# Altium project Gimbal 2020.PrjPcb
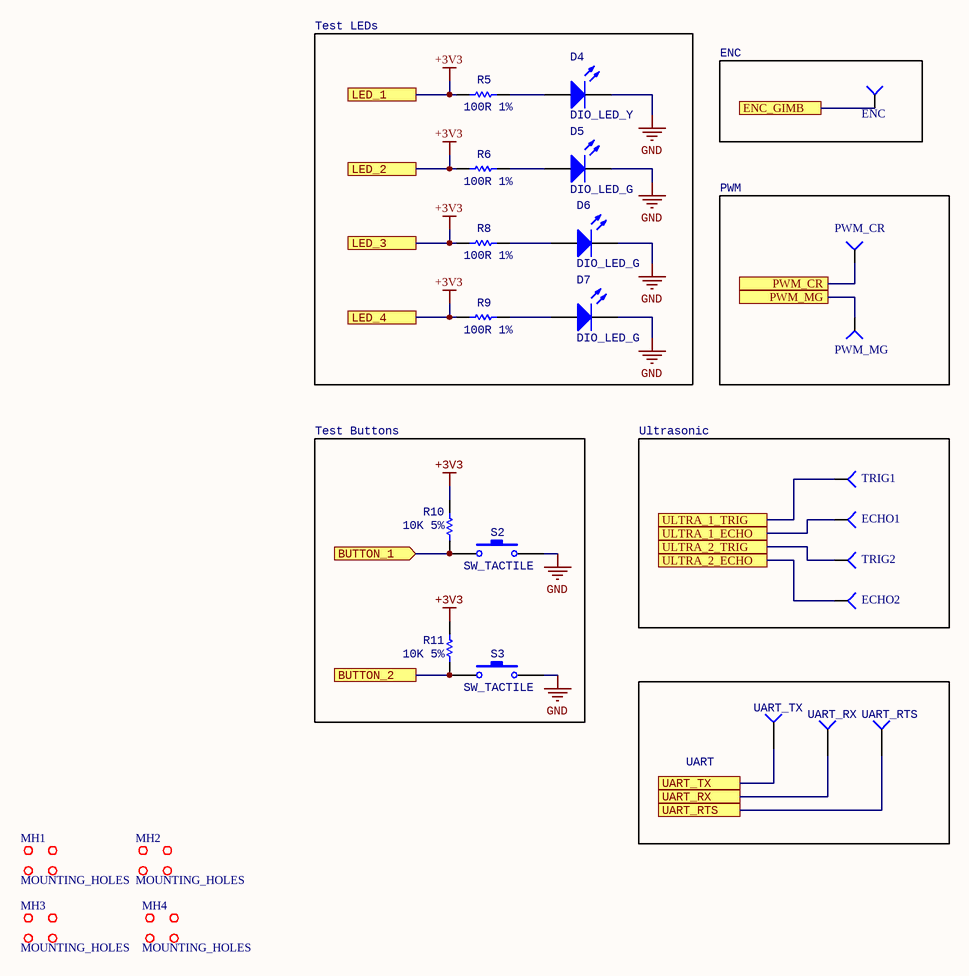
[diagram p0: Support.SchDoc]
5 sheets, 79 parts. Net scope: flat (ports and power ports of the same name join across sheets).
Sheets:
  Support.SchDoc
  Connectors.SchDoc
  POWER.SchDoc
  can.SchDoc
  MCU.SchDoc

## Sheet Support.SchDoc: Gimbal Support Schematic
size Letter; DrawnBy: Aidan Gratton; Organization: UW Robotics; Address1: 200 University Avenue; Address2: Waterloo; Address3: Ontario; Address4: Canada N2L 3G6; SheetNumber: 4; SheetTotal: 5

### Parts
D4  DIO_LED_Y  [LED_0805_LINE]
D5  DIO_LED_G  [LED_0805_LINE]
D6  DIO_LED_G  [LED_0805_LINE]
D7  DIO_LED_G  [LED_0805_LINE]
MH1  MOUNTING_HOLES  [MOUNTING_HOLE]
MH2  MOUNTING_HOLES  [MOUNTING_HOLE]
MH3  MOUNTING_HOLES  [MOUNTING_HOLE]
MH4  MOUNTING_HOLES  [MOUNTING_HOLE]
R5  value 100R 1%  [RESC0603(1608)_N]  (hidden comment: RES_100R_0603)
R6  value 100R 1%  [RESC0603(1608)_N]  (hidden comment: RES_100R_0603)
R8  value 100R 1%  [RESC0603(1608)_N]  (hidden comment: RES_100R_0603)
R9  value 100R 1%  [RESC0603(1608)_N]  (hidden comment: RES_100R_0603)
R10  value 10K 5%  [RESC0603(1608)_N]  (hidden comment: RES_10K_0603)
R11  value 10K 5%  [RESC0603(1608)_N]  (hidden comment: RES_10K_0603)
S2  SW_TACTILE  [B3U-1100P]
S3  SW_TACTILE  [B3U-1100P]
TP8  TRIG1  [TESTPOINT]
TP9  PWM_CR  [TESTPOINT]
TP10  ENC  [TESTPOINT]
TP11  ECHO1  [TESTPOINT]
TP12  TRIG2  [TESTPOINT]
TP13  ECHO2  [TESTPOINT]
TP14  PWM_MG  [TESTPOINT]
UART_RTS  TESTPOINT  (value not drawn)
UART_RX  TESTPOINT  (value not drawn)
UART_TX  TESTPOINT  (value not drawn)

### Blocks framed on the sheet
Test LEDs: D4-D7 R5 R6 R8 R9
ENC: TP10
PWM: TP9 TP14
Test Buttons: R10 R11 S2 S3
Ultrasonic: TP8 TP11-TP13
UART: UART_RTS UART_RX UART_TX

### Ports
BUTTON_1 (in), BUTTON_2, ENC_GIMB, LED_1, LED_2, LED_3, LED_4, PWM_CR, PWM_MG, UART_RTS, UART_RX, UART_TX, ULTRA_1_ECHO, ULTRA_1_TRIG, ULTRA_2_ECHO, ULTRA_2_TRIG

### Nets
+3V3: R5.1 R6.1 R8.1 R9.1 R10.1 R11.2 ; port LED_1, port LED_2, port LED_3, port LED_4
GND: D4.2(K) D5.2(K) D6.2(K) D7.2(K) S2.2 S3.2
NetD4_1: D4.1(A) R5.2
NetD5_1: D5.1(A) R6.2
NetD6_1: D6.1(A) R8.2
NetD7_1: D7.1(A) R9.2
NetDEBUG_2: UART_TX.1(=value) ; port UART_TX
NetDEBUG_3: UART_RX.1(=value) ; port UART_RX
NetDEBUG_4: UART_RTS.1(=value) ; port UART_RTS
NetENC1_2: TP10.1(=value) ; port ENC_GIMB
NetR10_2: R10.2 S2.1 ; port BUTTON_1
NetR11_1: R11.1 S3.1 ; port BUTTON_2
NetSTM1_35: TP9.1(=value) ; port PWM_CR
NetSTM1_36: TP14.1(=value) ; port PWM_MG
NetSTM1_58: TP8.1(=value) ; port ULTRA_1_TRIG
NetSTM1_59: TP11.1(=value) ; port ULTRA_1_ECHO
NetSTM1_61: TP12.1(=value) ; port ULTRA_2_TRIG
NetSTM1_62: TP13.1(=value) ; port ULTRA_2_ECHO

### Notes on the sheet
- Title
- Size:
- Date:
- Letter
- Drawn By:
- Sheet
- of
- File:

### Library data of the parts
D4 = DIO_LED_Y: LED YELLOW DIFFUSED 0805 SMD; Manufacturer: OSRAM; MPN: LY R976-PS-36; Forward Voltage Drop: 2.2V; Package: 0805 (2012 Metric); Digikey Part Number: 475-2560-1-ND
D5-D7 = DIO_LED_G: LED GREEN DIFFUSED 0805 SMD; Manufacturer: OSRAM; MPN: LG R971-KN-1; Forward Voltage Drop: 2.2V; Package: 0805 (2012 Metric); Digikey Part Number: 475-1410-1-ND
MH1-MH4 = MOUNTING_HOLES: 6cm x 6cm
R5 R6 R8 R9 = RES_100R_0603: RES SMD 100 OHM 1% 1/10W 0603; Manufacturer: Yageo; MPN: RC0603FR-07100RL; Package: 0603 (1608 Metric); Dimensions: 0.063" L x 0.031" W (1.60mm x 0.80mm); Tolerance: 1%; Digikey Part Number: 311-100HRCT-ND
R10 R11 = RES_10K_0603: RES SMD 10K OHM 5% 1/10W 0603; Manufacturer: Yageo; MPN: RC0603JR-0710KL; Package: 0603 (1608 Metric); Dimensions: 0.063" L x 0.031" W (1.60mm x 0.80mm); Tolerance: 5%; Digikey Part Number: 311-10KGRCT-ND
S2 S3 = SW_TACTILE: Tactile Switch (Grey); Manufacturer: Omron Electronics Inc-EMC Div; Digikey Part Number: SW1021TR-ND; MPN: B3U-1100P
TP8-TP14 = TESTPOINT_SMD: Part Number (MPN): *

## Sheet Connectors.SchDoc: Gimbal Connecters Schematic
size Letter; DrawnBy: Jing Hao Yao & Aidan Gratton; Organization: UW Robotics; Address1: 200 University Avenue; Address2: Waterloo; Address3: Ontario; Address4: Canada N2L 3G6; SheetNumber: 5; SheetTotal: 5
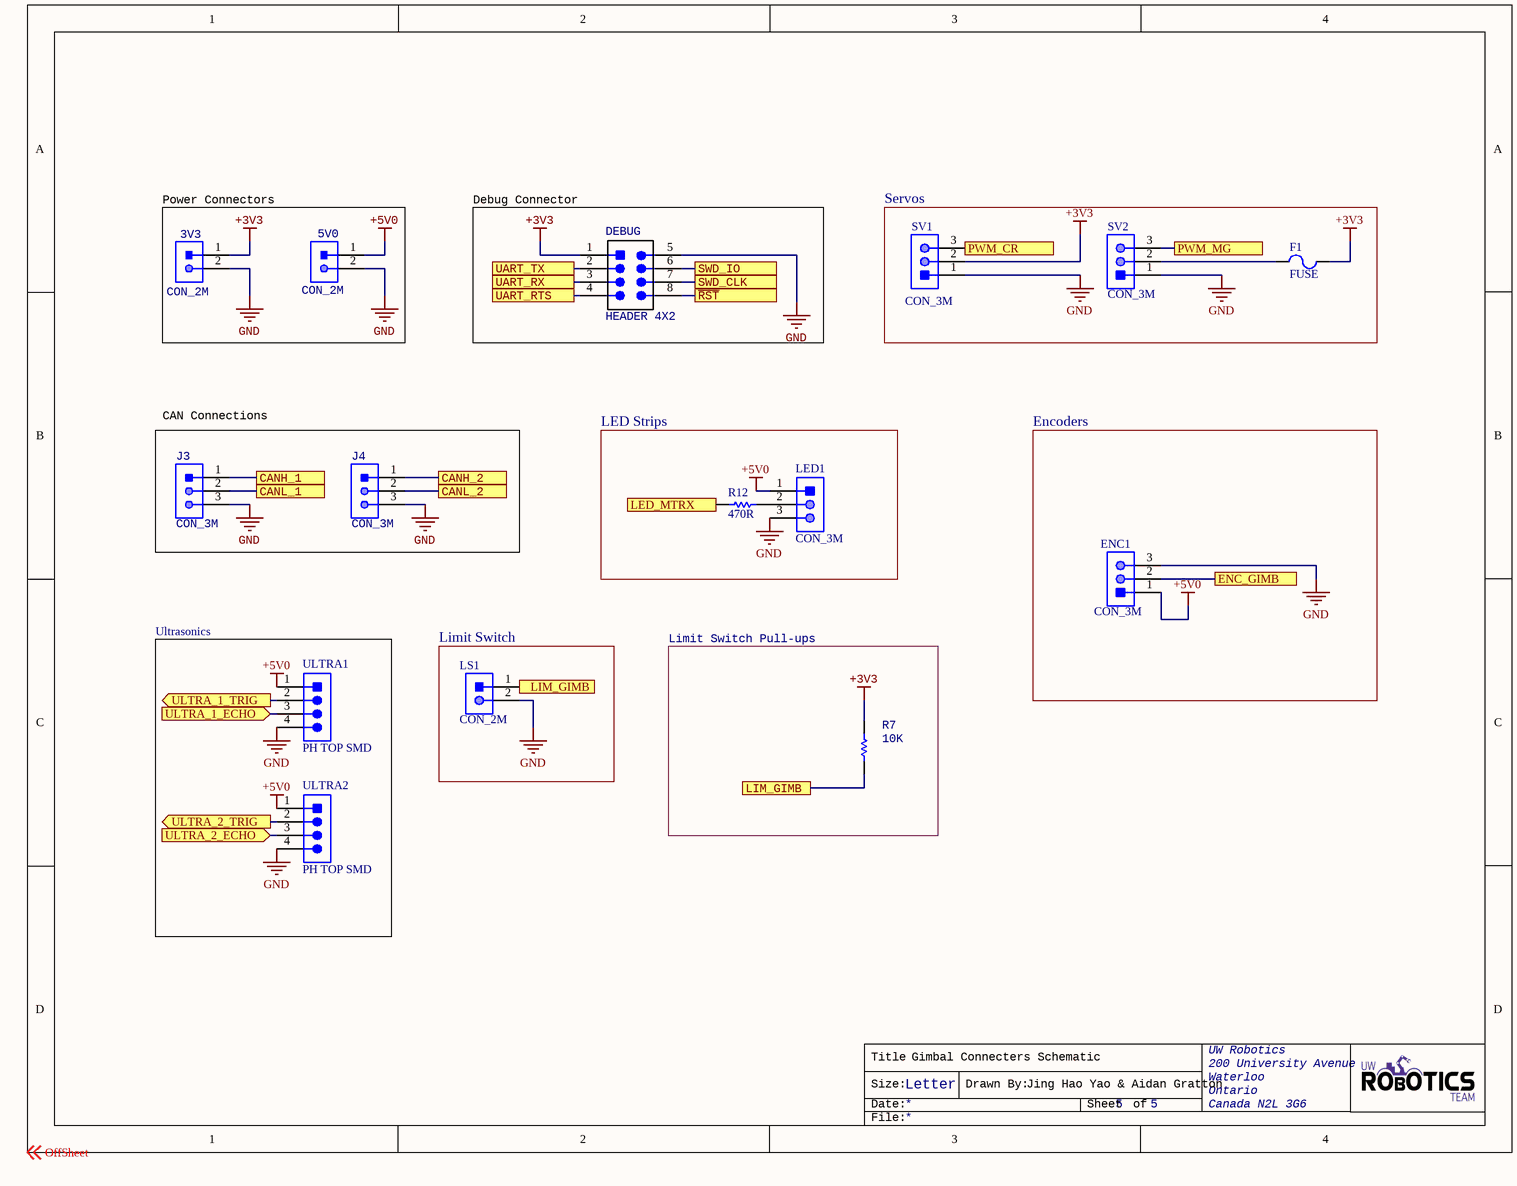
[diagram p1: Connectors.SchDoc]

### Parts
3V3  CON_2M  [JST-B2B-PHSK]
5V0  CON_2M  [JST-B2B-PHSK]
DEBUG  HEADER 4X2  [HEADER_2X4]
ENC1  CON_3M  [JST-B3B-SM4-TB]
F1  FUSE  [FUSE]
J3  CON_3M  [JST-B3B-SM4-TB]
J4  CON_3M  [JST-B3B-SM4-TB]
LED1  CON_3M  [JST-B3B-SM4-TB]
LS1  CON_2M  [JST-B2B-SM4-TB]
R7  value 10K  [RESC0603(1608)_N]  (hidden comment: RES_10K_0603)
R12  value 470R  [RESC0603(1608)_N]  (hidden comment: 470R 1%)
SV1  CON_3M  [JST-B3B-SM4-TB]
SV2  CON_3M  [JST B03B-PASK]
ULTRA1  PH TOP SMD  [JST-B4B-SM4-TB]
ULTRA2  PH TOP SMD  [JST-B4B-SM4-TB]

### Blocks framed on the sheet
Power Connectors: 3V3 5V0
Debug Connector: DEBUG
Servos: F1 SV1 SV2
CAN Connections: J3 J4
LED Strips: LED1 R12
Encoders: ENC1
Ultrasonics: ULTRA1 ULTRA2
Limit Switch: LS1
Limit Switch Pull-ups: R7

### Ports
CANH_1, CANH_2, CANL_1, CANL_2, ENC_GIMB, LED_MTRX, LIM_GIMB, PWM_CR, PWM_MG, SWD_CLK, SWD_IO, UART_RTS, UART_RX, UART_TX, ULTRA_1_ECHO (in), ULTRA_1_TRIG (out), ULTRA_2_ECHO (in), ULTRA_2_TRIG (out), ~{RST}

### Nets
+3V3: 3V3.1 DEBUG.1(VCC) F1.2 R7.2 SV1.2
+5V0: 5V0.1 ENC1.1 LED1.1 ULTRA1.1 ULTRA2.1
GND: 3V3.2 5V0.2 DEBUG.5(GND) ENC1.3 J3.3 J4.3 LED1.3 LS1.2 SV1.1 SV2.1 ULTRA1.4 ULTRA2.4
NetC5_2: DEBUG.8 ; port ~{RST}
NetD1_1: J4.1 ; port CANH_2
NetD1_2: J4.2 ; port CANL_2
NetD2_1: J3.1 ; port CANH_1
NetD2_2: J3.2 ; port CANL_1
NetDEBUG_2: DEBUG.2 ; port UART_TX
NetDEBUG_3: DEBUG.3 ; port UART_RX
NetDEBUG_4: DEBUG.4 ; port UART_RTS
NetDEBUG_6: DEBUG.6 ; port SWD_IO
NetDEBUG_7: DEBUG.7 ; port SWD_CLK
NetENC1_2: ENC1.2 ; port ENC_GIMB
NetF1_1: F1.1 SV2.2
NetLED1_2: LED1.2 R12.2
NetLS1_1: LS1.1 R7.1 ; port LIM_GIMB
NetR12_1: R12.1 ; port LED_MTRX
NetSTM1_35: SV1.3 ; port PWM_CR
NetSTM1_36: SV2.3 ; port PWM_MG
NetSTM1_58: ULTRA1.2 ; port ULTRA_1_TRIG
NetSTM1_59: ULTRA1.3 ; port ULTRA_1_ECHO
NetSTM1_61: ULTRA2.2 ; port ULTRA_2_TRIG
NetSTM1_62: ULTRA2.3 ; port ULTRA_2_ECHO

### Notes on the sheet
- Labels drawn without touching a wire or pin: OffSheet
- Title
- Size:
- Date:
- Letter
- Drawn By:
- Sheet
- of
- File:

### Library data of the parts
DEBUG = HEADER 4X2: Header, 4-Pin Dual row; MPN: GRPB042VWVN-RC; Manufacturer: Sullins Connector Solutions; Digikey Part Number: S9015E-04-ND
F1 = FUSE-5A: FUSE HOLDER RADIAL 250V 6.3A PCB
R7 = RES_10K_0603: as R10 on sheet Support; Package: 0603 (1608 Metric); Dimensions: 0.063" L x 0.031" W (1.60mm x 0.80mm); Tolerance: 5%; Digikey Part Number: 311-10KGRCT-ND
R12 = RES_470R_0603: RES SMD 470 OHM 1% 1/10W 0603; Manufacturer: Yageo; MPN: AC0603FR-07470RL; Package: 0603 (1608 Metric); Dimensions: 0.063" L x 0.031" W (1.60mm x 0.80mm); Tolerance: 1%; Digikey Part Number: 311-470LDCT-ND
ULTRA1 ULTRA2 = CON_4M_PH_TOP_SMT: CONN HEADER PH TOP 4POS 2MM SMD; Manufacturer: JST; Part Number: B4B-PH-SM4-TB; ComponentLink1Description: Datasheet; ComponentLink1URL: http://www.jst-mfg.com/product/pdf/eng/ePH.pdf

## Sheet POWER.SchDoc: Gimbal Power Schematic
size Letter; Author: Aidan Gratton; DrawnBy: Aidan Gratton; Organization: UW Robotics; Address1: 200 University Avenue; Address2: Waterloo; Address3: Ontario; Address4: Canada N2L 3G6; SheetNumber: 3; SheetTotal: 5
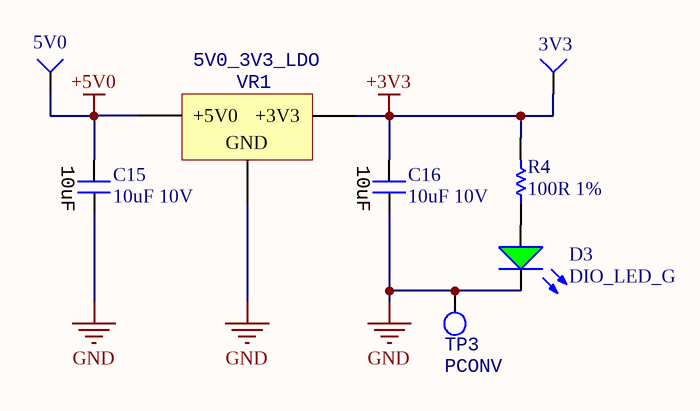
[diagram p2: POWER.SchDoc]

### Parts
C15  10uF 10V  [CAPC0603(1608)55_N]
C16  10uF 10V  [CAPC0603(1608)55_N]
D3  DIO_LED_G  [LED_0805_LINE]
R4  value 100R 1%  [RESC0603(1608)_N]  (hidden comment: RES_100R_0603)
T_3V3  3V3  [TESTPOINT]
TP1  5V0  [TESTPOINT]
TP3  PCONV  [TESTPOINT_LOOP]
VR1  5V0_3V3_LDO  [VOLTAGE_REGULATOR]

### Nets
+3V3: C16.1 R4.2 T_3V3.1(=value) VR1.3(+3V3)
+5V0: C15.1 TP1.1(=value) VR1.1(+5V0)
GND: C15.2 C16.2 D3.2(K) TP3.1 VR1.2(GND)
NetD3_1: D3.1(A) R4.1

### Notes on the sheet
- Title
- Size:
- Date:
- Letter
- Drawn By:
- Sheet
- of
- File:

### Library data of the parts
C15 C16 = CAP_10uF_0603: CAP CER 10UF 10V X5R 0603; MPN: CC0603MRX5R6BB106; Manufacturer: Yageo; Dimensions: 0.063" L x 0.031" W (1.60mm x 0.80mm); Package: 0603 (1608 Metric); Voltage Rating: 10V; Digikey Part Number: 311-1817-1-ND; Value: 10uF
D3 = DIO_LED_G: LED GREEN DIFFUSED 0805 SMD; MPN: LG R971-KN-1; Manufacturer: OSRAM; Forward Voltage Drop: 2.2V; Package: 0805 (2012 Metric); Digikey Part Number: 475-1410-1-ND
R4 = RES_100R_0603: as R5 on sheet Support; Package: 0603 (1608 Metric); Dimensions: 0.063" L x 0.031" W (1.60mm x 0.80mm); Tolerance: 1%; Digikey Part Number: 311-100HRCT-ND
T_3V3 TP1 = *: TESTPOINT_SMD; Part Number (MPN): *
TP3 = TESTPOINT_LOOP: Loop testpoint through-hole pad
VR1 = 5V0_3V3_LDO: IC REG LINEAR 3.3V 1A DPAK; Part Number: NCP1117DT33T5G; Manufacturer: ON Semiconductor; Current Output: 1A

## Sheet can.SchDoc: Gimbal CAN Schematic
size Letter; Author: Jing Hao Yao; DrawnBy: Jing Hao Yao; Organization: UW Robotics; Address1: 200 University Avenue; Address2: Waterloo; Address3: Ontario; Address4: Canada N2L 3G6; SheetNumber: 2; SheetTotal: 5
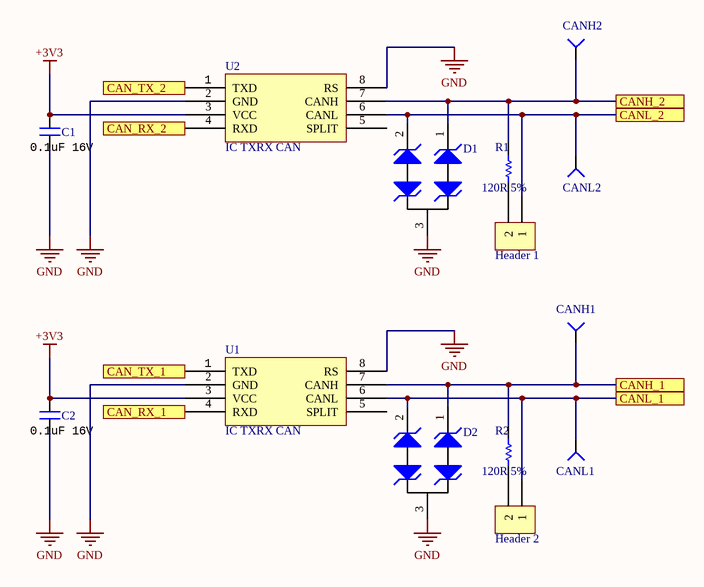
[diagram p3: can.SchDoc]

### Parts
C1  value 0.1uF 16V  [CAPC0603(1608)55_N]
C2  value 0.1uF 16V  [CAPC0603(1608)55_N]
D1  (no value)  [NXP-SOT323-3]
D2  (no value)  [NXP-SOT323-3]
Header_1  (no value)  [OSTYK51102030]
Header_2  (no value)  [OSTYK51102030]
R1  value 120R 5%  [RESC0603(1608)_N]
R2  value 120R 5%  [RESC0603(1608)_N]
TP4  CANH2  [TESTPOINT]
TP5  CANL2  [TESTPOINT]
TP6  CANH1  [TESTPOINT]
TP7  CANL1  [TESTPOINT]
U1  IC TXRX CAN  [LT-S8_N]
U2  IC TXRX CAN  [LT-S8_N]

### Ports
CAN_RX_1, CAN_RX_2, CAN_TX_1, CAN_TX_2, CANH_1, CANH_2, CANL_1, CANL_2

### Nets
+3V3: C1.2 C2.2 U1.3(VCC) U2.3(VCC)
GND: C1.1 C2.1 D1.3 D2.3 U1.2(GND) U1.8(RS) U2.2(GND) U2.8(RS)
NetD1_1: D1.1 R1.1 TP4.1(=value) U2.7(CANH) ; port CANH_2
NetD1_2: D1.2 Header_1.1 TP5.1(=value) U2.6(CANL) ; port CANL_2
NetD2_1: D2.1 R2.1 TP6.1(=value) U1.7(CANH) ; port CANH_1
NetD2_2: D2.2 Header_2.1 TP7.1(=value) U1.6(CANL) ; port CANL_1
NetHeader_1_2: Header_1.2 R1.2
NetHeader_2_2: Header_2.2 R2.2
NetSTM1_33: U2.4(RXD) ; port CAN_RX_2
NetSTM1_34: U2.1(TXD) ; port CAN_TX_2
NetSTM1_44: U1.4(RXD) ; port CAN_RX_1
NetSTM1_45: U1.1(TXD) ; port CAN_TX_1

Not connected (* = marked no-connect by the designer): U1 5(SPLIT); U2 5(SPLIT)

### Notes on the sheet
- Title
- Size:
- Date:
- Letter
- Drawn By:
- Sheet
- of
- File:

### Library data of the parts
C1 C2 = CAP_0.1uF_16V_0603: CAP CER 0.1UF 16V X7R 0603; MPN: CC0603KRX7R7BB104; Manufacturer: Yageo; Dimensions: 0.063" L x 0.031" W (1.60mm x 0.80mm); Package: 0603 (1608 Metric); Temperature Coefficient: X7R; Voltage Rating: 16V; Digikey Part Number: 311-1088-1-ND
D1 D2 = TVS_DIODE_CAN: TVS DIODE 24V 41V SOT323-3; MPN: PESD2CAN,215; Manufacturer: Nexperia USA Inc.; Package: SC-70, SOT-323; ComponentLink1Description: Datasheet; ComponentLink1URL: https://assets.nexperia.com/documents/data-sheet/PESD1CAN-U.pdf; Digikey Part Number: 1727-3891-1-ND
Header_1 Header_2 = TERMINAL_2: Header, 2-Pin; Manufacturer: On Shore Technology Inc.; MPN: OSTYK51102030; Digikey Part Number: ED2953-ND
R1 R2 = RES_120R_0603: RES SMD 120 OHM 5% 1/10W 0603; Manufacturer: Yageo; MPN: RC0603JR-07120RL; Package: 0603 (1608 Metric); Dimensions: 0.063" L x 0.031" W (1.60mm x 0.80mm); Tolerance: 5%; Digikey Part Number: 311-120GRCT-ND
TP4-TP7 = TESTPOINT_SMD: Part Number (MPN): *
U1 U2 = LTC2875: IC TXRX CAN 4MBPS 8SO; Manufacturer: Linear Technologies; MPN: LTC2875IS8#PBF; Package: 8-SOIC (0.154", 3.90mm Width); ComponentLink1Description: Datasheet; ComponentLink1URL: https://www.analog.com/media/en/technical-documentation/data-sheets/2875f.pdf; Digikey Part Number: LTC2875IS8#PBF-ND

## Sheet MCU.SchDoc: Gimbal MCU Schematic
size Letter; DrawnBy: Jing Hao Yao; Organization: UW Robotics; Address1: 200 University Avenue; Address2: Waterloo; Address3: Ontario; Address4: Canada N2L 3G6; SheetNumber: 1; SheetTotal: 5
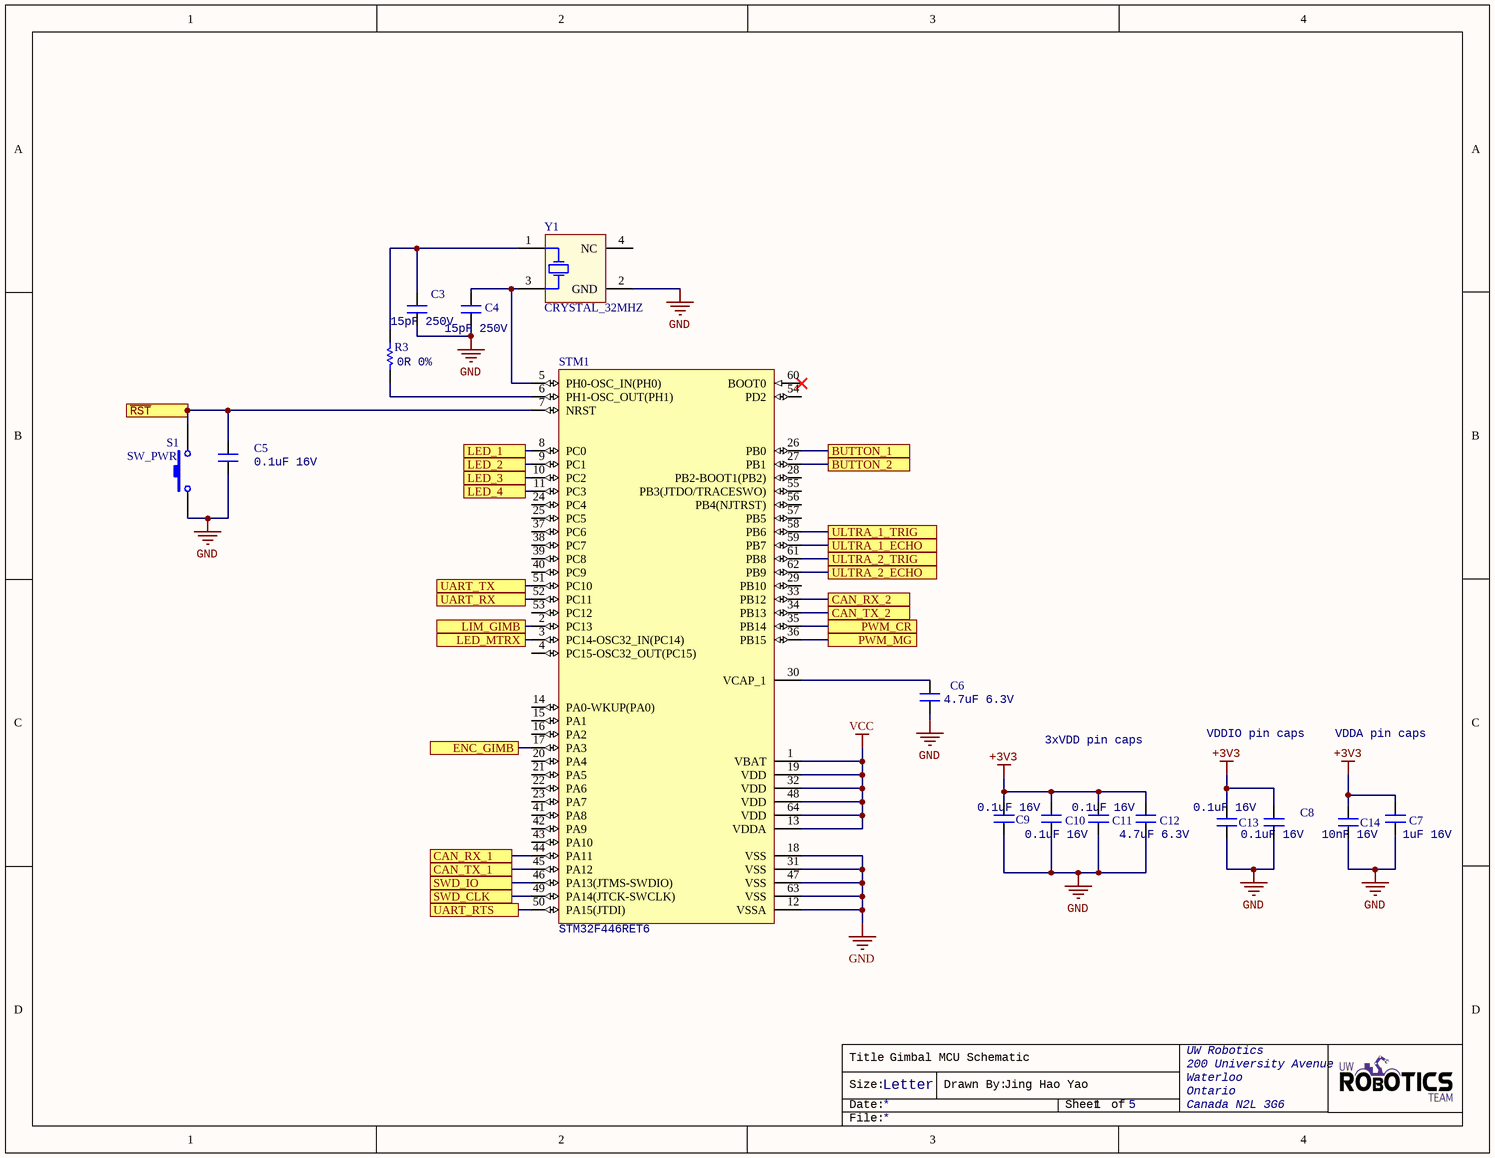
[diagram p4: MCU.SchDoc]

### Parts
C3  value 15pF 250V  [CAPC0603(1608)55_N]  (hidden comment: CAP_15pF_0603)
C4  value 15pF 250V  [CAPC0603(1608)55_N]  (hidden comment: CAP_15pF_0603)
C5  value 0.1uF 16V  [CAPC0603(1608)55_N]  (hidden comment: CAP_0.1uF_16V_0603)
C6  value 4.7uF 6.3V  [CAPC0603(1608)55_N]  (hidden comment: CAP_4.7uF_0603)
C7  value 1uF 16V  [CAPC0603(1608)55_N]  (hidden comment: CAP_1uF_16V_0603)
C8  value 0.1uF 16V  [CAPC0603(1608)55_N]  (hidden comment: CAP_0.1uF_16V_0603)
C9  value 0.1uF 16V  [CAPC0603(1608)55_N]  (hidden comment: CAP_0.1uF_16V_0603)
C10  value 0.1uF 16V  [CAPC0603(1608)55_N]  (hidden comment: CAP_0.1uF_16V_0603)
C11  value 0.1uF 16V  [CAPC0603(1608)55_N]  (hidden comment: CAP_0.1uF_16V_0603)
C12  value 4.7uF 6.3V  [CAPC0603(1608)55_N]  (hidden comment: CAP_4.7uF_0603)
C13  value 0.1uF 16V  [CAPC0603(1608)55_N]  (hidden comment: CAP_0.1uF_16V_0603)
C14  value 10nF 16V  [CAPC0603(1608)55_N]  (hidden comment: CAP_10nF_0603)
R3  value 0R 0%  [RESC0603(1608)_N]  (hidden comment: RES_0R_0603)
S1  SW_PWR  [PTS830GM140]
STM1  STM32F446RET6  [STM-LQFP64_L]
Y1  CRYSTAL_32MHZ  [AVX-CX2520DB32000D0GEJZ1-4_V]

### Ports
BUTTON_1, BUTTON_2, CAN_RX_1, CAN_RX_2, CAN_TX_1, CAN_TX_2, ENC_GIMB, LED_1, LED_2, LED_3, LED_4, LED_MTRX, LIM_GIMB, PWM_CR, PWM_MG, SWD_CLK, SWD_IO, UART_RTS, UART_RX, UART_TX, ULTRA_1_ECHO, ULTRA_1_TRIG, ULTRA_2_ECHO, ULTRA_2_TRIG, ~{RST} (in)

### Nets
+3V3: C7.2 C8.2 C9.2 C10.2 C11.2 C12.2 C13.2 C14.2 STM1.8(PC0) STM1.9(PC1) STM1.10(PC2) STM1.11(PC3) ; port LED_1, port LED_2, port LED_3, port LED_4
GND: C3.1 C4.1 C5.1 C6.1 C7.1 C8.1 C9.1 C10.1 C11.1 C12.1 C13.1 C14.1 S1.1 STM1.12(VSSA) STM1.18(VSS) STM1.31(VSS) STM1.47(VSS) STM1.63(VSS) Y1.2(GND)
VCC: STM1.1(VBAT) STM1.13(VDDA) STM1.19(VDD) STM1.32(VDD) STM1.48(VDD) STM1.64(VDD)
NetC3_2: C3.2 R3.2 Y1.1(HOT)
NetC4_2: C4.2 STM1.5(PH0-OSC_IN(PH0)) Y1.3(HOT)
NetC5_2: C5.2 S1.2 STM1.7(NRST) ; port ~{RST}
NetC6_2: C6.2 STM1.30(VCAP_1)
NetDEBUG_2: STM1.51(PC10) ; port UART_TX
NetDEBUG_3: STM1.52(PC11) ; port UART_RX
NetDEBUG_4: STM1.50(PA15(JTDI)) ; port UART_RTS
NetDEBUG_6: STM1.46(PA13(JTMS-SWDIO)) ; port SWD_IO
NetDEBUG_7: STM1.49(PA14(JTCK-SWCLK)) ; port SWD_CLK
NetENC1_2: STM1.17(PA3) ; port ENC_GIMB
NetLS1_1: STM1.2(PC13) ; port LIM_GIMB
NetR3_1: R3.1 STM1.6(PH1-OSC_OUT(PH1))
NetR10_2: STM1.26(PB0) ; port BUTTON_1
NetR11_1: STM1.27(PB1) ; port BUTTON_2
NetR12_1: STM1.3(PC14-OSC32_IN(PC14)) ; port LED_MTRX
NetSTM1_33: STM1.33(PB12) ; port CAN_RX_2
NetSTM1_34: STM1.34(PB13) ; port CAN_TX_2
NetSTM1_35: STM1.35(PB14) ; port PWM_CR
NetSTM1_36: STM1.36(PB15) ; port PWM_MG
NetSTM1_44: STM1.44(PA11) ; port CAN_RX_1
NetSTM1_45: STM1.45(PA12) ; port CAN_TX_1
NetSTM1_58: STM1.58(PB6) ; port ULTRA_1_TRIG
NetSTM1_59: STM1.59(PB7) ; port ULTRA_1_ECHO
NetSTM1_61: STM1.61(PB8) ; port ULTRA_2_TRIG
NetSTM1_62: STM1.62(PB9) ; port ULTRA_2_ECHO

Not connected (* = marked no-connect by the designer): STM1 4(PC15-OSC32_OUT(PC15)) 14(PA0-WKUP(PA0)) 15(PA1) 16(PA2) 20(PA4) 21(PA5) 22(PA6) 23(PA7) 24(PC4) 25(PC5) 28(PB2-BOOT1(PB2)) 29(PB10) 37(PC6) 38(PC7) 39(PC8) 40(PC9) 41(PA8) 42(PA9) 43(PA10) 53(PC12) 54(PD2) 55(PB3(JTDO/TRACESWO)) 56(PB4(NJTRST)) 57(PB5) 60(BOOT0)*; Y1 4(NC)

### Notes on the sheet
- 3xVDD pin caps
- VDDIO pin caps
- VDDA pin caps
- Title
- Size:
- Date:
- Letter
- Drawn By:
- Sheet
- of
- File:

### Library data of the parts
C3 C4 = CAP_15pF_0603: CAP CER 15PF 250V NPO 0603; Manufacturer: Yageo; MPN: AC0603JRNPOYBN150; Temperature Coefficient: NP0; Dimensions: 0.063" L x 0.031" W (1.60mm x 0.80mm); Package: 0603 (1608 Metric); Voltage Rating: 250v; Digikey Part Number: 311-3282-1-ND
C5 C8-C11 C13 = CAP_0.1uF_16V_0603: CAP CER 0.1UF 16V X7R 0603; Manufacturer: Yageo; MPN: CC0603KRX7R7BB104; Dimensions: 0.063" L x 0.031" W (1.60mm x 0.80mm); Package: 0603 (1608 Metric); Temperature Coefficient: X7R; Voltage Rating: 16V; Digikey Part Number: 311-1088-1-ND
C6 C12 = CAP_4.7uF_0603: CAP CER 4.7UF 6.3V X5R 0603; Manufacturer: Yageo; MPN: CC0603KRX5R5BB475; Dimensions: 0.063" L x 0.031" W (1.60mm x 0.80mm); Package: 0603 (1608 Metric); Temperature Coefficient: X5R; Voltage Rating: 6.3V; Digikey Part Number: 311-1521-1-ND
C7 = CAP_1uF_16V_0603: CAP CER 1UF 16V Y5V 0603; Manufacturer: Yageo; MPN: CC0603ZRY5V7BB105; Dimensions: 0.063" L x 0.031" W (1.60mm x 0.80mm); Package: 0603 (1608 Metric); Temperature Coefficient: Y5V; Voltage Rating: 16V; Digikey Part Number: 311-1372-1-ND
C14 = CAP_10nF_0603: CAP CER 10000PF 16V X7R 0603; Manufacturer: Yageo; MPN: CC0603KRX7R7BB103; Dimensions: 0.063" L x 0.031" W (1.60mm x 0.80mm); Package: 0603 (1608 Metric); Temperature Coefficient: X7R; Voltage Rating: 16V; Digikey Part Number: 311-3369-1-ND
R3 = RES_0R_0603: RES SMD 0 OHM JUMPER 1/10W 0603; Manufacturer: Yageo; MPN: RC0603JR-070RL; Package: 0603 (1608 Metric); Dimensions: 0.063" L x 0.031" W (1.60mm x 0.80mm); Digikey Part Number: 311-0.0GRCT-ND
S1 = SW_PWR: Power Switch (Red); pin to pad: 2>4; MPN: PTS830GM140 SMTR LFS; Manufacturer: C&K; ComponentLink1Description: Datasheet; ComponentLink1URL: https://www.ckswitches.com/media/1478/pts830.pdf; Digikey Part Number: CKN10587CT-ND
STM1 = MCU_STM32F446RET6: ARM Cortex-M4 32-bit MCU+FPU, 512 KB Flash, 128 KB Internal RAM, 50 I/Os, 64-Pin LQFP, -40 to 85 degC, Tray; I/Os (High Current): 50; Supply Voltage(Vcc) min (V): 1.7; Operating Frequency(F) (Processor speed) (MHz): 180; D/A Converter: 2; Internal RAM Size (kB): 128; FLASH Size (Prog) (kB): 512; Core: ARM Cortex-M4; ComponentLink1Description: Manufacturer URL; Package Reference: 64-Pin Low-profile Quad Flat Package, Body 10 x 10 mm, Pitch 0.5 mm; ComponentLink2URL: http://www.st.com/st-web-ui/static/active/en/resource/technical/document/datasheet/DM00141306.pdf; Packing: Tray; DatasheetVersion: Rev. 6; ComponentLink1URL: http://www.st.com/; ComponentLink2Description: Datasheet; Package Description: LQFP64; Mounting Technology: Surface Mount
Y1 = CRYSTAL_32MHZ: CRYSTAL 32MHZ 8PF SMD; Manufacturer: Kyocera International Inc. Electronic Components; MPN: CX2520DB32000D0GPSC1; Package: 4-SMD, No Lead; Dimensions: 0.098" L x 0.079" W (2.50mm x 2.00mm); Digikey Part Number: 1253-1730-1-ND

## Nets that join several sheets
+3V3: Support (6 pins), Connectors (5 pins), POWER (C16.1 R4.2 T_3V3.1 VR1.3), can (C1.2 C2.2 U1.3 U2.3), MCU (12 pins)
+5V0: Connectors (5 pins), POWER (C15.1 TP1.1 VR1.1)
GND: Support (6 pins), Connectors (12 pins), POWER (5 pins), can (8 pins), MCU (19 pins)
NetC5_2: Connectors (DEBUG.8), MCU (C5.2 S1.2 STM1.7)
NetD1_1: Connectors (J4.1), can (D1.1 R1.1 TP4.1 U2.7)
NetD1_2: Connectors (J4.2), can (D1.2 Header_1.1 TP5.1 U2.6)
NetD2_1: Connectors (J3.1), can (D2.1 R2.1 TP6.1 U1.7)
NetD2_2: Connectors (J3.2), can (D2.2 Header_2.1 TP7.1 U1.6)
NetDEBUG_2: Support (UART_TX.1), Connectors (DEBUG.2), MCU (STM1.51)
NetDEBUG_3: Support (UART_RX.1), Connectors (DEBUG.3), MCU (STM1.52)
NetDEBUG_4: Support (UART_RTS.1), Connectors (DEBUG.4), MCU (STM1.50)
NetDEBUG_6: Connectors (DEBUG.6), MCU (STM1.46)
NetDEBUG_7: Connectors (DEBUG.7), MCU (STM1.49)
NetENC1_2: Support (TP10.1), Connectors (ENC1.2), MCU (STM1.17)
NetLS1_1: Connectors (LS1.1 R7.1), MCU (STM1.2)
NetR10_2: Support (R10.2 S2.1), MCU (STM1.26)
NetR11_1: Support (R11.1 S3.1), MCU (STM1.27)
NetR12_1: Connectors (R12.1), MCU (STM1.3)
NetSTM1_33: can (U2.4), MCU (STM1.33)
NetSTM1_34: can (U2.1), MCU (STM1.34)
NetSTM1_35: Support (TP9.1), Connectors (SV1.3), MCU (STM1.35)
NetSTM1_36: Support (TP14.1), Connectors (SV2.3), MCU (STM1.36)
NetSTM1_44: can (U1.4), MCU (STM1.44)
NetSTM1_45: can (U1.1), MCU (STM1.45)
NetSTM1_58: Support (TP8.1), Connectors (ULTRA1.2), MCU (STM1.58)
NetSTM1_59: Support (TP11.1), Connectors (ULTRA1.3), MCU (STM1.59)
NetSTM1_61: Support (TP12.1), Connectors (ULTRA2.2), MCU (STM1.61)
NetSTM1_62: Support (TP13.1), Connectors (ULTRA2.3), MCU (STM1.62)